# Altium schematic sheet 12_USB_HUB.SchDoc
size 297 x 209 mm
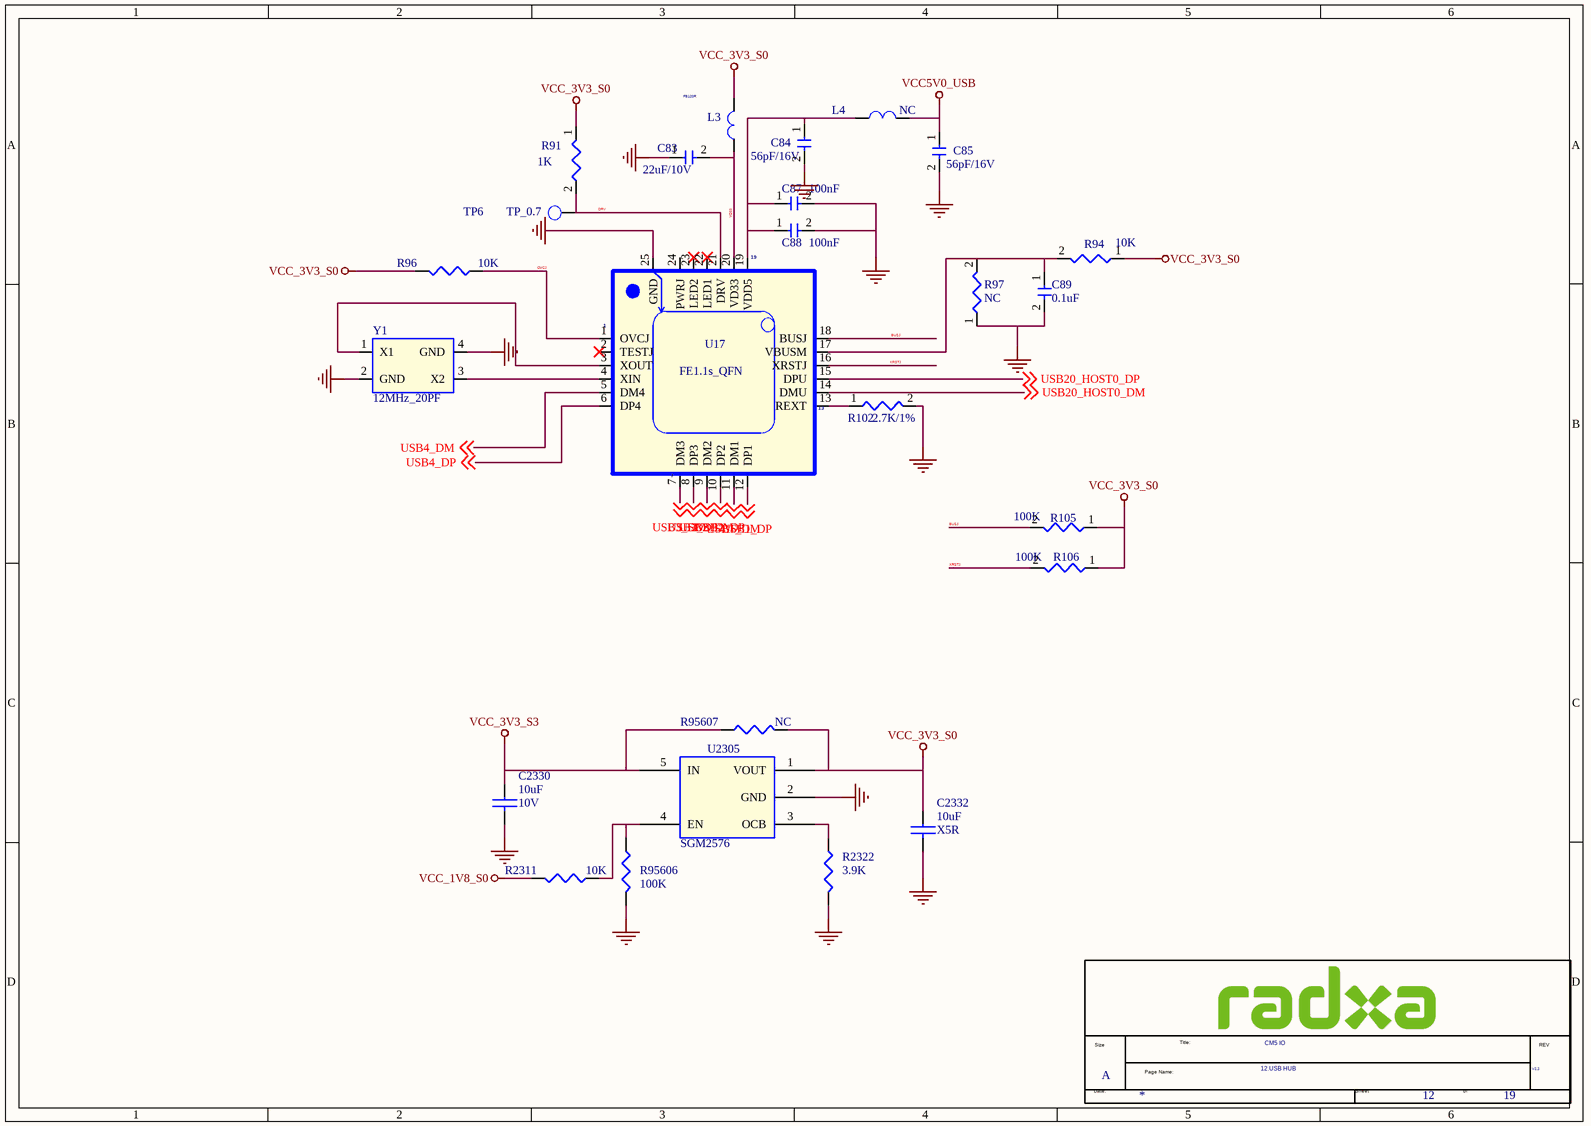
[diagram p0: 12_USB_HUB.SchDoc]

## Parts
*  Doc: 12.USB HUB  RevCode: V2.2  Title: CM5 IO  Page Size: A  Page Number: 12  Page Count: 19  (hidden comment: radxa_1010)  (graphical)
C83  22uF/10V  [C0603]
C84  56pF/16V  [C0603]
C85  56pF/16V  [C0603]
C87  100nF  [C0603]
C88  100nF  [C0603]
C89  0.1uF  [C0603]
C2330  10uF  Voltage: 10V  [C0603]
C2332  10uF  Dielectric: X5R  [C0603]
L3  FB120R  [R0402]
L4  NC  [L0402]
R91  1K  [R0603]
R94  10K  [R0603]
R96  10K  [R0402]
R97  NC  [R0603]
R102  2.7K/1%  [R0603]
R105  100K  [R0603]
R106  100K  [R0603]
R2311  10K  [R0402]
R2322  3.9K  [R0402]
R95606  100K  [R0402]
R95607  NC  [R0402]
TP6  TP_0.7  [TEST]
U17  FE1.1s_QFN  [QFN24]
U2305  SGM2576  [SOT_23_5]
Y1  12MHz_20PF  [CRY-3225]

## Nets
GND: C83.1 C84.2 C85.2 C87.2 C88.2 C89.2 C2330.2 C2332.2 R97.1 R102.2 R2322.2 R95606.1 U17.25(GND) U2305.2(GND) Y1.2(GND) Y1.4(GND)
VCC5V0_USB: C85.1 L4.1
VCC_1V8_S0: R2311.1
VCC_3V3_S0: C2332.1 L3.2 R91.1 R94.1 R96.1 R105.1 R106.1 R95607.2 U2305.1(VOUT)
VCC_3V3_S3: C2330.1 R95607.1 U2305.5(IN)
BUSJ: R105.2 U17.18(BUSJ)
DRV: R91.2 TP6.1 U17.21(DRV)
OVCJ: R96.2 U17.1(OVCJ)
USB1_DM: U17.11(DM1) ; off-sheet USB1_DM
USB1_DP: U17.12(DP1) ; off-sheet USB1_DP
USB2_DM: U17.9(DM2) ; off-sheet USB2_DM
USB2_DP: U17.10(DP2) ; off-sheet USB2_DP
USB3_DM: U17.7(DM3) ; off-sheet USB3_DM
USB3_DP: U17.8(DP3) ; off-sheet USB3_DP
USB4_DM: U17.5(DM4) ; off-sheet USB4_DM
USB4_DP: U17.6(DP4) ; off-sheet USB4_DP
USB20_HOST0_DM: U17.14(DMU) ; off-sheet USB20_HOST0_DM
USB20_HOST0_DP: U17.15(DPU) ; off-sheet USB20_HOST0_DP
VD33: C83.2 L3.1 U17.20(VD33)
XRSTJ: R106.2 U17.16(XRSTJ)
NetC84_1: C84.1 C87.1 C88.1 L4.2 U17.19(VDD5)
NetC89_1: C89.1 R94.2 R97.2 U17.17(VBUSM)
NetR102_1: R102.1 U17.13(REXT)
NetR2311_2: R2311.2 R95606.2 U2305.4(EN)
NetR2322_1: R2322.1 U2305.3(OCB)
NetU17_3: U17.3(XOUT) Y1.1(X1)
NetU17_4: U17.4(XIN) Y1.3(X2)

Not connected (* = marked no-connect by the designer): U17 2(TESTJ)* 22(LED1)* 23(LED2)* 24(PWRJ)

## Notes on the sheet
- (in symbol radxa_1010) Size; Title:; REV; Page Name:; Date:; Sheet; of

## Library data of the parts
C83 = CAP_0.1uF_0603: PCB Footprint: C0603
C84 C85 C87-C89 = CAP_0.1uF_0603: PCB Footprint: C0402
C2330 = CAP NP_0_Dup2: cap,10.00uF,+/-10%,10V,X5R,C0603; Manufacturer PN: C1608X5R1A106K080AC; Manufacturer: TDK; Tolerance: 10%; C_Voltage: 6.3V; Priority: A; PCB Footprint: C0603; Dielectric: X5R; Created by: JJJ; Part Type: C0603; RK PN: C1608X5R1A106K080AC
C2332 = CAP NP_0_Dup2: cap,10.00uF,+/-10%,10V,X5R,C0603; Manufacturer: TDK; RK PN: C1608X5R1A106K080AC; Priority: A; C_Voltage: 6.3V; Tolerance: 10%; Voltage: 10V; PCB Footprint: C0603; Part Type: C0603; Manufacturer PN: C1608X5R1A106K080AC; Created by: JJJ
L3 L4 = CHOKE RF
  L3: PCB Footprint: R0402
  L4: PCB Footprint: L0402
R91 R94 R97 R102 R105 R106 = RES_0603: PCB Footprint: R0402
R96 = RESISTOR_0_Dup3: 通用厚膜电阻,0R,+/-5%,R0402,1/16W.; Manufacturer PN: RC0402JR-070RL; Manufacturer: YAGEO; Tolerance: 5%; option: DNP; Wattage: 1/16W; Priority: A; PCB Footprint: R0402; Created by: YTL; Part Type: 通用厚膜电阻; RK PN: RC0402JR-070RL
R2311 = RESISTOR_1_Dup1: 通用厚膜电阻,10K,+/-5%,R0402,1/16W.; Manufacturer: YAGEO; Tolerance: 5%; RK PN: RC0402JR-0710KL; Priority: A; Wattage: 1/16W; PCB Footprint: R0402; Part Type: 通用厚膜电阻; Manufacturer PN: RC0402JR-0710KL; Created by: YTL
R2322 = RESISTOR_1_Dup1: 通用厚膜电阻,4K7,+/-5%,R0402,1/16W.; Manufacturer PN: RC0402JR-074K7L; Manufacturer: YAGEO; Tolerance: 5%; Wattage: 1/16W; Priority: A; PCB Footprint: R0402; Created by: YTL; Part Type: 通用厚膜电阻; RK PN: RC0402JR-074K7L
R95606 = RESISTOR_1_Dup1: 通用厚膜电阻,10K,+/-5%,R0402,1/16W.; Manufacturer PN: RC0402JR-0710KL; Manufacturer: YAGEO; Tolerance: 5%; Wattage: 1/16W; Priority: A; PCB Footprint: R0402; Created by: YTL; Part Type: 通用厚膜电阻; RK PN: RC0402JR-0710KL
R95607 = RESISTOR_1_Dup1: 通用厚膜电阻,4K7,+/-5%,R0402,1/16W.; Manufacturer: YAGEO; PCB Footprint: R0603; Tolerance: 5%; RK PN: RC0402JR-074K7L; Priority: A; Wattage: 1/16W; Part Type: 通用厚膜电阻; Manufacturer PN: RC0402JR-074K7L; Created by: YTL
TP6 = TP: Test Point 0.7mm; PCB Footprint: TP_0R70; RK PN: TESTPOINT_0R7; Priority: A; Part Type: TP; Created by: JJJ
U17 = FE1_1s_B_QFN24_2: PCB Footprint: QFN24
U2305 = SWITCH_SY6280: 1A Current Limited Load Switch; Manufacturer PN: TT9107; Manufacturer: Torch-chip（汤诚电子）; Priority: A; PCB Footprint: SOT_23_5; Created by: JJJ; Part Type: Switch; RK PN: TT9107
Y1 = CRYSTAL_4P: 无源晶振，25M，3225,±10ppm，10pF，Hosonic; Manufacturer: Hosonic(鸿星电子); PCB Footprint: CRY4_3R20X2R50X0R80; RK PN: E3SB25.0000F10E11; Priority: A; Part Type: CRYSTAL; Manufacturer PN: E3SB25.0000F10E11; Created by: JJJ
* = radxa_1010: Page Create Date: March  8, 1995; Page Modify Date: *